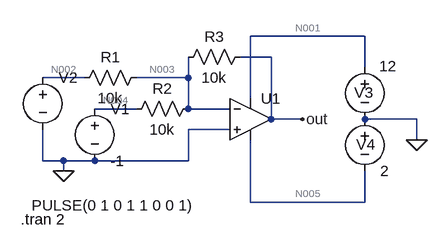
[diagram p0: schematic color-mixer.asc]
color-mixer.asc, the LTspice schematic file:
Version 4
SHEET 1 880 680
WIRE 352 32 176 32
WIRE 208 64 160 64
WIRE 352 80 352 32
WIRE -80 96 -144 96
WIRE 80 96 80 64
WIRE 80 96 0 96
WIRE 176 128 176 32
WIRE 0 144 -64 144
WIRE 80 144 80 96
WIRE 144 144 80 144
WIRE 208 160 208 64
WIRE 256 160 208 160
WIRE 432 160 352 160
WIRE 144 176 80 176
WIRE 432 192 432 160
WIRE -144 224 -144 176
WIRE -112 224 -144 224
WIRE -64 224 -112 224
WIRE 80 224 80 176
WIRE 80 224 -64 224
WIRE -112 240 -112 224
WIRE 176 288 176 192
WIRE 352 288 352 240
WIRE 352 288 176 288
FLAG -112 240 0
FLAG 432 192 0
FLAG 256 160 out
SYMBOL Opamps\\UniversalOpamp2 176 160 R0
SYMATTR InstName U1
SYMBOL voltage -64 128 R0
WINDOW 123 0 0 Left 2
WINDOW 39 0 0 Left 2
SYMATTR InstName V1
SYMATTR Value -1
SYMBOL voltage -144 80 R0
WINDOW 3 -17 213 Left 2
WINDOW 123 0 0 Left 2
WINDOW 39 0 0 Left 2
SYMATTR Value PULSE(0 1 0 1 1 0 0 1)
SYMATTR InstName V2
SYMBOL res -96 112 R270
WINDOW 0 32 56 VTop 2
WINDOW 3 0 56 VBottom 2
SYMATTR InstName R1
SYMATTR Value 10k
SYMBOL res -16 160 R270
WINDOW 0 32 56 VTop 2
WINDOW 3 0 56 VBottom 2
SYMATTR InstName R2
SYMATTR Value 10k
SYMBOL res 64 80 R270
WINDOW 0 32 56 VTop 2
WINDOW 3 0 56 VBottom 2
SYMATTR InstName R3
SYMATTR Value 10k
SYMBOL voltage 352 64 R0
WINDOW 0 -16 55 Left 2
WINDOW 3 22 14 Left 2
WINDOW 123 0 0 Left 2
WINDOW 39 0 0 Left 2
SYMATTR InstName V3
SYMATTR Value 12
SYMBOL voltage 352 144 R0
WINDOW 0 -13 55 Left 2
WINDOW 123 0 0 Left 2
WINDOW 39 0 0 Left 2
SYMATTR InstName V4
SYMATTR Value 2
TEXT -178 314 Left 2 !.tran 2

The netlist it stands for:
* color-mixer.asc
XU1 0 N003 N001 N005 out level.2 Avol=1Meg GBW=10Meg Slew=10Meg ilimit=25m rail=0 Vos=0 phimargin=45 en=0 enk=0 in=0 ink=0 Rin=500Meg  ; pins IN+ IN- V+ V- OUT
V1 N004 0 -1
V2 N002 0 PULSE(0 1 0 1 1 0 0 1)
R1 N002 N003 10k
R2 N004 N003 10k
R3 N003 out 10k
V3 N001 0 12
V4 0 N005 2
.tran 2
.lib UniversalOpamps2.sub
.backanno
.end

* Results of the author's LTspice run, read from the files saved beside the schematic
* Operating Point, zero values left out:
*   V(out) = 999.9 mV
*   V(n001) = 12 V
*   V(n005) = -2 V
*   V(n003) = 4.013 µV
*   V(n004) = -1 V
*   I(R3) = -99.99 µA
*   I(R2) = -100 µA
*   I(R1) = -401.3 pA
*   I(V4) = -526.5 µA
*   I(V3) = -626.6 µA
*   I(V2) = 401.3 pA
*   I(V1) = 100 µA
*   Ix(u1:1) = -10 nA
*   Ix(u1:2) = -10 nA
*   Ix(u1:3) = 626.6 µA
*   Ix(u1:4) = -526.5 µA
*   Ix(u1:5) = -99.99 µA
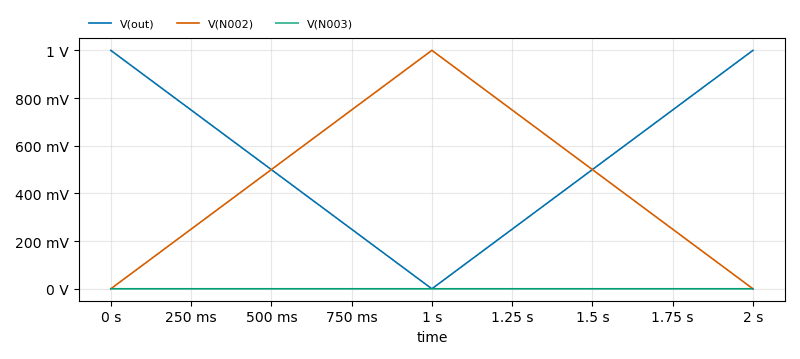
[diagram p1: Transient Analysis of color-mixer.asc, plotted from the saved traces]
* Transient Analysis, 1 run:
*   V(out): min -84.89 µV, max 999.9 mV, average 499.9 mV, rms 611.1 mV, last 999.9 mV
*   V(N002): min 0 V, max 1 V, average 500 mV, rms 611.2 mV, last 0 V
*   V(N003): min 3.997 µV, max 5.037 µV, average 4.515 µV, rms 4.53 µV, last 3.997 µV